# Altium schematic sheet power.SchDoc
size A
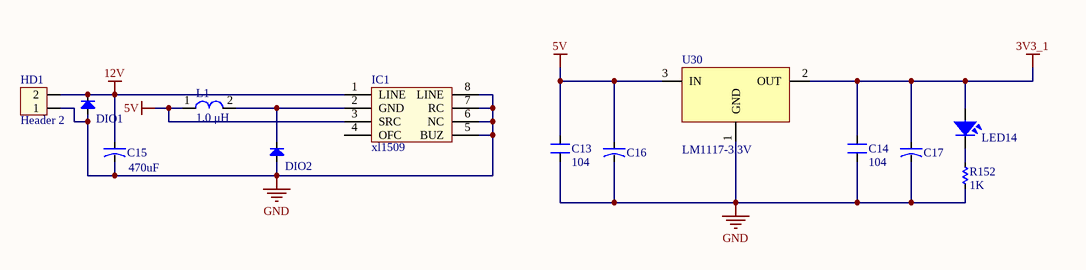
[diagram p0: power.SchDoc]

## Parts
C13  104  [SM-CAP-0805]
C14  104  [SM-CAP-0805]
C15  470uF  [CAP-ALU-SMD-6.3x7.7x2.2]
C16  CN-ALU-SMD  [CAP-ALU-SMD-4.5x5x1.4]  (value not drawn)
C17  CN-ALU-SMD  [CAP-ALU-SMD-4.5x5x1.4]  (value not drawn)
DIO1  Diode SMD  [DIO-SMD-106]  (value not drawn)
DIO2  Diode SMD  [DIO-SMD-106]  (value not drawn)
HD1  Header 2  [HED2]
IC1  xl1509  [SO-8]
L1  1.0 μH  [L-SMD-M-7.3x4.5]
LED14  LED  [LED-0805-Blue]  (value not drawn)
R152  1K  [RES-SMD-0805]
U30  LM1117-3.3V  [SOT223]

## Nets
3V3_1: C14.2 C17.1 LED14.1 U30.2(OUT)
5V: C13.2 C16.1 IC1.3(SRC) L1.1 U30.3(IN)
12V: C15.1 DIO1.2(K) HD1.2 IC1.1(LINE)
GND: C13.1 C14.1 C15.2 C16.2 C17.2 DIO1.1(A) DIO2.1(A) HD1.1 IC1.5(BUZ) IC1.6(NC) IC1.7(RC) IC1.8(LINE) R152.2 U30.1(GND)
NetDIO2_2: DIO2.2(K) IC1.2(GND) L1.2
NetLED14_2: LED14.2 R152.1

Not connected (* = marked no-connect by the designer): IC1 4(OFC)

## Library data of the parts
C13 C14 = CN: Value: 0,1uF/300V; Designed by: VanDungEvn
C15-C17 = CN-ALU-SMD: Polarized Capacitor (Axial); Published: 8-Jun-2000; LatestRevisionDate: 17-Jul-2002; LatestRevisionNote: Re-released for DXP Platform.; PackageReference: POLAR0.8; Publisher: Altium Limited
DIO1 DIO2 = Diode SMD: Default Diode; Code - JEDEC: DO-214-AB; Value: 1N5007; Published: 8-Jun-2000; Revision: July-2002: Re-released for DXP Platform.; Publisher: Altium Limited
HD1 = Hed2: Header 2 (Green); Value: Header 2
IC1 = LS1240A: Electronic Two-Tone Ringer
L1 = L-SMD-1: partNo: 78477010; Manufacturer: Wurth Elektronik; Inductance: 1.0 μH; ComponentLink1Description: Manufacturer; ComponentLink1URL: http://www.we-online.de; Created by: Baojun Chen; Created Date: Nov.2015; ComponentLink2Description: Datasheet; ComponentLink2URL: http://katalog.we-online.de/pbs/datasheet/78477010.pdf
LED14 = LED SMD: Value: LED 3 - 5 ly 2 Colour
R152 = Res-SMD: Resistor; Manufacturer: Generic Components; Class: Passive; Published: 08/06/2000; Publisher: Altium Hobart Technology Centre
U30 = LM1117: 800mA Low-Dropout Linear Regulator; Creator: Nguyen Ba Bien; Website: http://group3i.net